# EAGLE design PIC10F220_M000A (EAGLE 7.4.0)
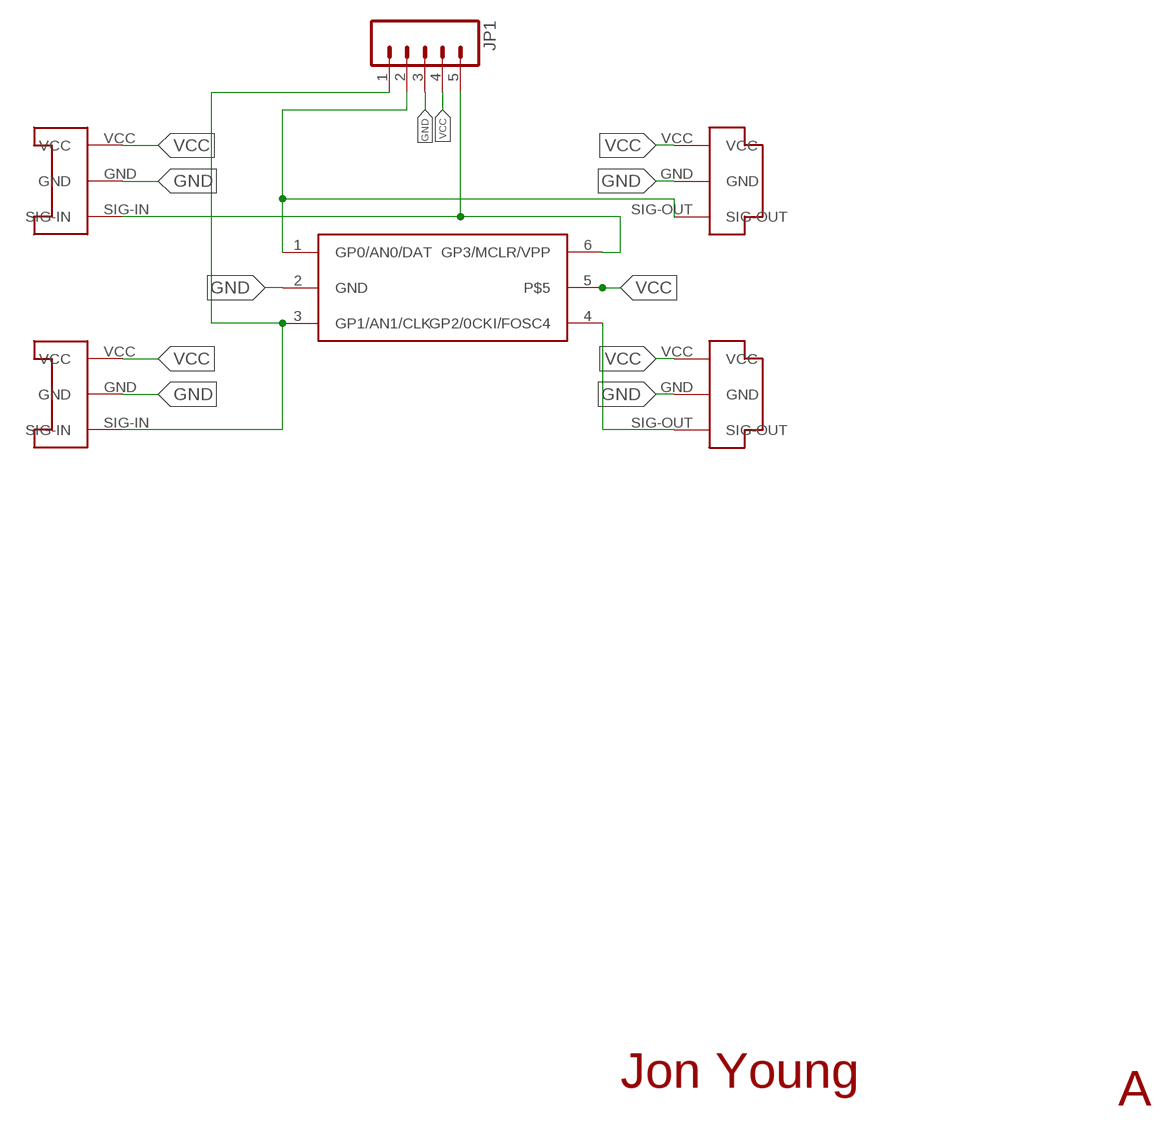
[diagram p0: schematic, sheet 1]

## Parts
JP1  M051.27MM  [1X05-1.27MM]
U$1  CONN-PLUG-3POS-3MM  [PLUG-3POS-3MM-SMD]
U$2  CONN-SOCKET-3POS-3MM  [SOCKET-3POS-3MM-SMD]
U$3  CONN-SOCKET-3POS-3MM  [SOCKET-3POS-3MM-SMD]
U$4  CONN-PLUG-3POS-3MM  [PLUG-3POS-3MM-SMD]
U$5  PIC10F2XXT-I/OT  [SOT23-6]

## Nets
GND: JP1.3 U$1.GND U$2.GND U$3.GND U$4.GND
N$5: U$1.SIG-OUT U$5.4(GP2/0CKI/FOSC4)
N$6: JP1.1 U$2.SIG-IN U$5.3(GP1/AN1/CLK)
N$8: JP1.2 U$4.SIG-OUT U$5.1(GP0/AN0/DAT)
N$9: JP1.5 U$3.SIG-IN U$5.6(GP3/MCLR/VPP)
VCC: JP1.4 U$1.VCC U$2.VCC U$3.VCC U$4.VCC U$5.5

## Notes on the sheet
- Jon Young
- A

## Power pins joined to a net without a drawn wire
GND: U$5.2(GND)

## Library data of the parts
JP1 = SparkFun-Connectors:M05: Header 5 Standard 5-pin 0.1" header. Use with straight break away headers (SKU : PRT-00116), right angle break away headers (PRT-00553), swiss pins (PRT-00743), machine pins (PRT-00117), and female headers (PRT-00115). Molex polarized connector foot print use with SKU : PRT-08230 with associated crimp pins and housings.
U$1 U$4 = EmbeddedPlayground:CONN-PLUG-3POS-3MM: Surface mount board to board connector. Female socket, 3 position.
U$2 U$3 = EmbeddedPlayground:CONN-SOCKET-3POS-3MM: Surface mount board to board connector. Female socket, 3 position.
U$5 = EmbeddedPlayground:PIC10F2XXT-I/OT

## Board
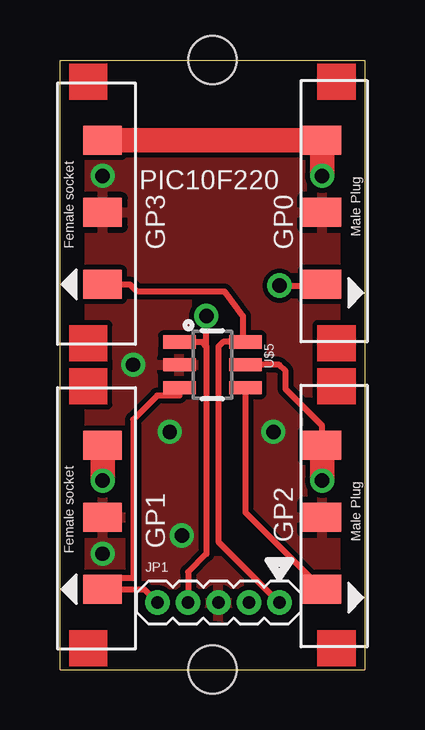
[diagram p1: board, top side]
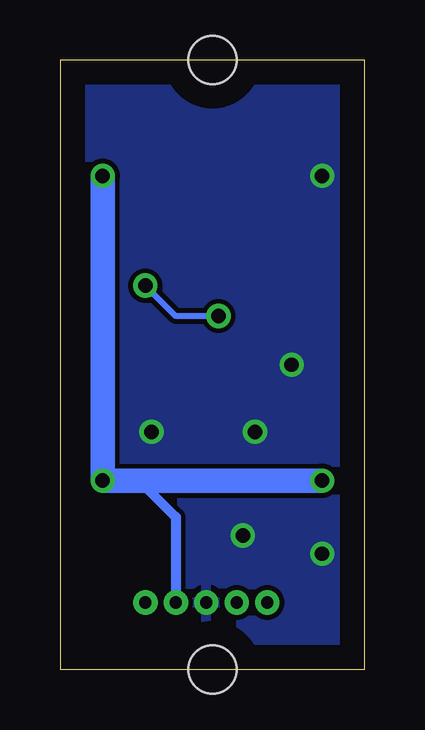
[diagram p2: board, bottom side, seen from below]

Size 12.7 x 25.4 mm. Coordinates in mm from the lower left corner, seen from the top.
Outline: 0,0 12.7,0 12.7,25.4 0,25.4 0,0
Copper layers (1*16): Top 0.035mm / dielectric 1.5mm / Bottom 0.035mm
Design rules "default": minimum track width 10mil, minimum drill 24mil, track to track 8mil, track to pad 8mil, pad to pad 8mil, via to via 8mil, smd to smd 8mil, copper to edge 40mil, drill to drill 8mil, minimum pad ring 10mil, minimum via ring 8mil, stop-mask expansion 4mil, vias tented up to drill 0mil, thermal gap 10mil
Holes 2 mm at 6.35,0 6.35,25.4

### Footprints (pad centres in the part's own frame; a part is rotated, then mirrored left to right if it is on the bottom)
1X05-1.27MM = drill 0.508 pad 1: 1 0,0; 2 1.27,0; 3 2.54,0; 4 3.81,0; 5 5.08,0
PLUG-3POS-3MM-SMD = smd 1.2 x 1.6: GND 0,0; SIG-OUT 3,0; VCC -3,0
SOCKET-3POS-3MM-SMD = smd 1.2 x 1.6: GND 0,0; SIG-IN -3,0; VCC 3,0
SOT23-6 = smd 0.55 x 1.35: 1 -0.95,-1.375; 2 0,-1.375; 3 0.95,-1.375; 4 0.95,1.375; 5 0,1.375; 6 -0.95,1.375

### Placement (x,y rotation side)
JP1  4.06,2.79 0 top
U$1  10.92,6.35 270 top
U$2  1.78,6.35 90 top
U$3  1.78,19.05 90 top
U$4  10.92,19.05 270 top
U$5  6.35,12.7 270 top

### Tracks (layer width: path | path; a pad name or v marks a point on that pad's centre or on a via)
GND  (via drill 0.6)
  other vias: 1.78,4.83 5.08,5.59 1.78,20.57 3.05,12.7 4.57,9.91 8.89,9.91
  pour Top: -1.27,31.69 -1.27,-1.27 16.42,-1.27 16.42,31.69
  pour Bottom: -1.27,31.69 16.42,31.69 16.42,-1.27 -1.27,-1.27
N$5
  Top 0.254: U$5.4 7.72,6.55 U$1.SIG-OUT
N$6
  Top 0.254: U$5.3 4.97,11.41 4.05,11.41 3.05,10.41 3.05,3.81 2.24,3.81 U$2.SIG-IN 3.51,3.35 JP1.1
N$8  (via drill 0.6)
  Top 0.254: U$5.1 5.91,13.65 6.1,13.46 | 6.1,13.46 6.1,4.83 5.33,4.06 JP1.2 | 6.1,13.46 v6.1,14.73 | v9.14,16 10.87,16 U$4.SIG-OUT
  Bottom 0.254: v6.1,14.73 7.87,14.73 v9.14,16
N$9
  Top 0.254: JP1.5 6.6,5.33 6.6,13.46 6.79,13.65 U$5.6 7.62,13.76 7.62,14.73 6.86,15.75 3.21,15.75 2.91,16.05 U$3.SIG-IN
N$10  (via drill 0.6)
  other vias: 6.1,14.73
N$11  (via drill 0.6)
  other vias: 9.14,16
VCC  (via drill 0.6)
  Top 0.254: U$1.VCC 10.92,10.16 9.4,11.68 9.4,12.45 9.14,12.7 U$5.5
  Top 1.016: U$3.VCC U$4.VCC v10.92,20.57 | U$1.VCC v10.92,7.87 | U$2.VCC v1.78,7.87
  Bottom 0.406: JP1.4 7.87,6.35 9.4,7.87 v10.92,7.87
  Bottom 1.016: v1.78,7.87 v10.92,7.87 v10.92,20.57

### Text on the board
tPlace: PIC10F220 | GP3 | GP0 | GP2 | GP1